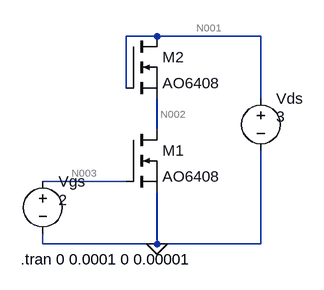
[diagram p0: schematic MOS_inverter.asc]
MOS_inverter.asc, the LTspice schematic file:
Version 4
SHEET 1 880 680
WIRE 208 -16 160 -16
WIRE 368 -16 208 -16
WIRE 160 64 160 -16
WIRE 368 80 368 -16
WIRE 208 128 208 80
WIRE 160 208 32 208
WIRE 32 304 32 288
WIRE 208 304 208 224
WIRE 208 304 32 304
WIRE 368 304 368 160
WIRE 368 304 208 304
FLAG 208 304 0
SYMBOL nmos 160 128 R0
SYMATTR InstName M1
SYMATTR Value AO6408
SYMBOL voltage 368 64 R0
WINDOW 3 24 44 Left 2
WINDOW 123 0 0 Left 2
WINDOW 39 0 0 Left 2
SYMATTR InstName Vds
SYMATTR Value 3
SYMBOL voltage 32 192 R0
WINDOW 3 24 44 Left 2
WINDOW 123 0 0 Left 2
WINDOW 39 0 0 Left 2
SYMATTR InstName Vgs
SYMATTR Value 2
SYMBOL nmos 160 -16 R0
SYMATTR InstName M2
SYMATTR Value AO6408
TEXT -2 328 Left 2 !.tran 0 0.0001 0 0.00001

The netlist it stands for:
* MOS_inverter.asc
M1 N002 N003 0 0 AO6408
Vds N001 0 3
Vgs N003 0 2
M2 N001 N001 N002 N002 AO6408
.model NMOS NMOS
.model PMOS PMOS
.lib standard.mos
.tran 0 0.0001 0 0.00001
.backanno
.end

* Results of the author's LTspice run, read from the files saved beside the schematic
* Operating Point, zero values left out:
*   V(n002) = 1.013 V
*   V(n003) = 2 V
*   V(n001) = 3 V
*   Id(M2) = 33.73 A
*   Is(M2) = -33.73 A
*   Id(M1) = 33.73 A
*   Is(M1) = -33.73 A
*   I(Vds) = -33.73 A